# EAGLE design ucbeacon (EAGLE 6.6.0)

## Sheet 1 of 3: Logic
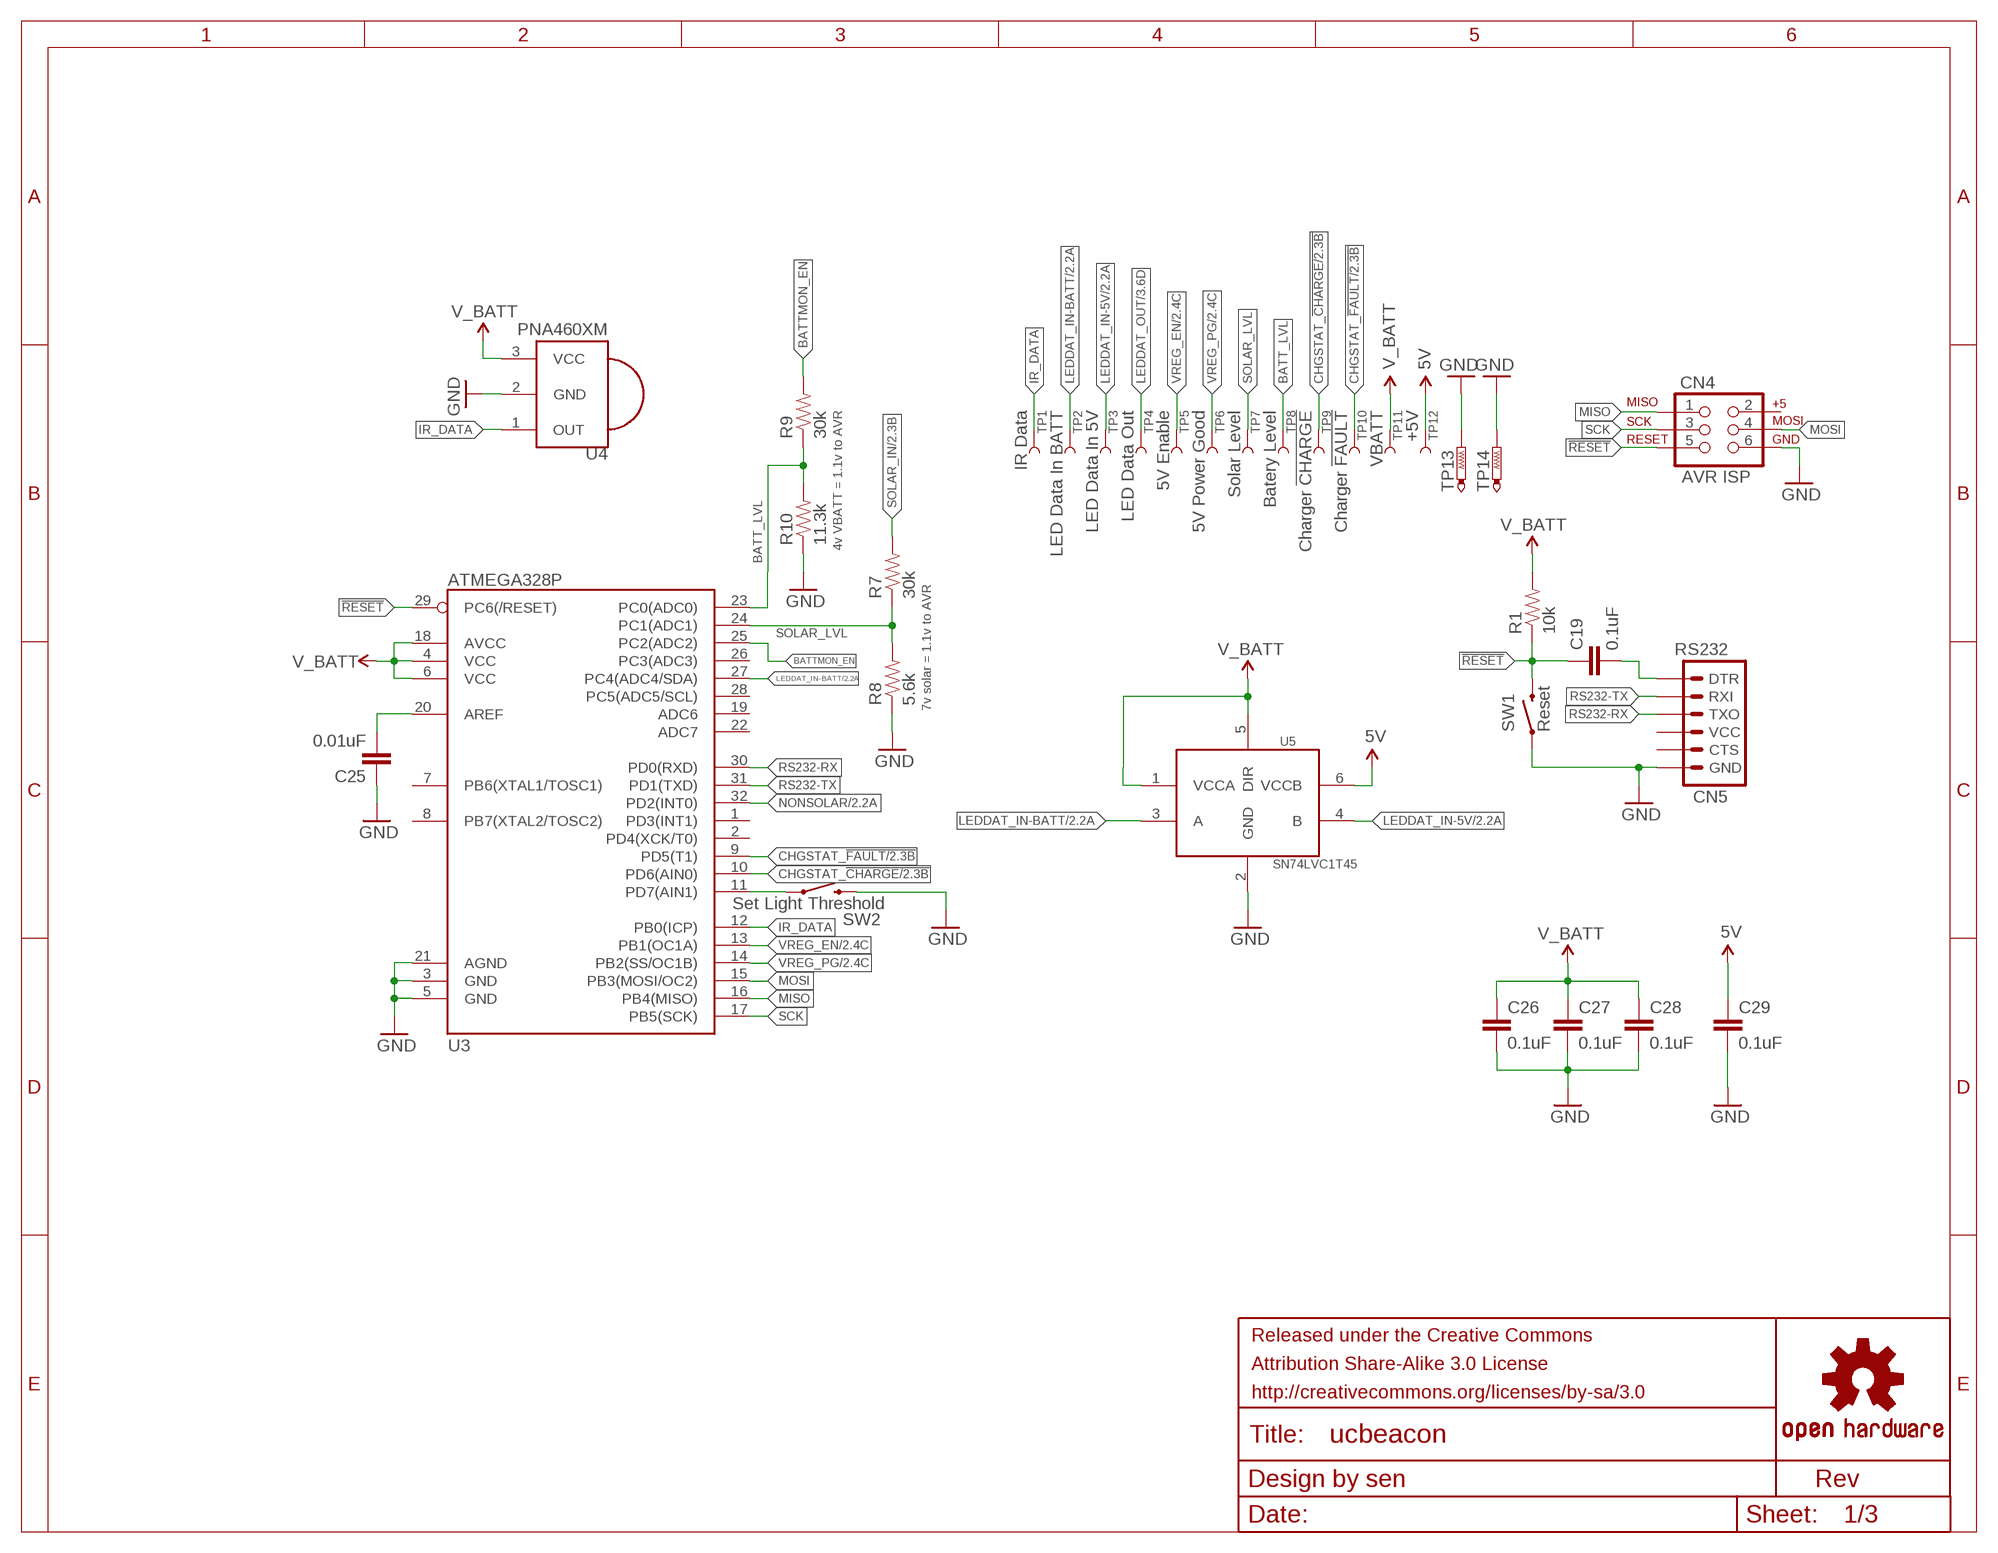
[diagram p0: schematic, sheet 1]

### Parts
C19  0.1uF  0.1UF-25V(+80/-20%)(0603)  [0603-CAP]
C25  0.01uF  0.1UF-25V(+80/-20%)(0603)  [0603-CAP]
C26  0.1uF  0.1UF-25V(+80/-20%)(0603)  [0603-CAP]
C27  0.1uF  0.1UF-25V(+80/-20%)(0603)  [0603-CAP]
C28  0.1uF  0.1UF-25V(+80/-20%)(0603)  [0603-CAP]
C29  0.1uF  0.1UF-25V(+80/-20%)(0603)  [0603-CAP]
CN4  AVR ISP  AVR_SPI_PRG_62X3_LOCK  [2X3_LOCK]
CN5  RS232  ARDUINO_SERIAL_PROGRAMLOCK  [1X06_LOCK]
FRAME2  FRAME-LETTER-GRID-OSHW-SENOSHW-LOGO-L  [OSHW-LOGO-L]
R1  10k  RESISTOR0603-RES  [0603-RES]
R7  30k  RESISTOR0603-RES  [0603-RES]
R8  5.6k  RESISTOR0603-RES  [0603-RES]
R9  30k  RESISTOR0603-RES  [0603-RES]
R10  11.3k  RESISTOR0603-RES  [0603-RES]
SW1  Reset  SWITCH-MOMENTARY-2SMD-4  [TACTILE_SWITCH_TALL]
SW2  Set Light Threshold  SWITCH-MOMENTARY-2SMD-4  [TACTILE_SWITCH_TALL]
TP1  IR Data  TEST-POINTTP_15PTH-MASKBOT  [TP_15TH-MASKBOT]
TP2  LED Data In BATT  TEST-POINTTP_15PTH-MASKBOT  [TP_15TH-MASKBOT]
TP3  LED Data In 5V  TEST-POINTTP_15PTH-MASKBOT  [TP_15TH-MASKBOT]
TP4  LED Data Out  TEST-POINTTP_15PTH-MASKBOT  [TP_15TH-MASKBOT]
TP5  5V Enable  TEST-POINTTP_15PTH-MASKBOT  [TP_15TH-MASKBOT]
TP6  5V Power Good  TEST-POINTTP_15PTH-MASKBOT  [TP_15TH-MASKBOT]
TP7  Solar Level  TEST-POINTTP_15PTH-MASKBOT  [TP_15TH-MASKBOT]
TP8  Batery Level  TEST-POINTTP_15PTH-MASKBOT  [TP_15TH-MASKBOT]
TP9  Charger !CHARGE  TEST-POINTTP_15PTH-MASKBOT  [TP_15TH-MASKBOT]
TP10  Charger !FAULT  TEST-POINTTP_15PTH-MASKBOT  [TP_15TH-MASKBOT]
TP11  VBATT  TEST-POINTTP_15PTH-MASKBOT  [TP_15TH-MASKBOT]
TP12  +5V  TEST-POINTTP_15TH_THRU  [TP_15TH]
TP13  GND  PTR1PAD1-13  [P1-13]
TP14  GND  PTR1PAD1-13  [P1-13]
U3  ATMEGA328P  ATMEGA328_SMT  [TQFP32-08]
U4  PNA460XM  [PNA460XM]
U5  SN74LVC1T45  [SOT23-6L]

### Nets
5V: C29.1 TP12.P$1 U5.6(VCCB) ; also sheet 2,3
!RESET: C19.1 CN4.5 R1.1 SW1.B2 U3.29(PC6(/RESET))
AREF: C25.2 U3.20(AREF)
BATT_LVL: R9.1 R10.2 TP8.P$1 U3.23(PC0(ADC0))
BATTMON_EN: R9.2 U3.25(PC2(ADC2))
CHGSTAT_!CHARGE: TP9.P$1 U3.10(PD6(AIN0)) ; also sheet 2
CHGSTAT_!FAULT: TP10.P$1 U3.9(PD5(T1)) ; also sheet 2
DTR_RESET: C19.2 CN5.1(DTR)
GND: C25.1 C26.2 C27.2 C28.2 C29.2 CN4.6 CN5.6(GND) R8.1 R10.1 SW1.A2 SW2.B2 TP13.TP TP14.TP U3.3(GND) U3.5(GND) U3.21(AGND) U4.2(GND) U5.2(GND) ; also sheet 2,3
IR_DATA: TP1.P$1 U3.12(PB0(ICP)) U4.1(OUT)
LEDDAT_IN-5V: TP3.P$1 U5.4(B) ; also sheet 2,3
LEDDAT_IN-BATT: TP2.P$1 U3.27(PC4(ADC4/SDA)) U5.3(A) ; also sheet 2
LEDDAT_OUT: TP4.P$1 ; also sheet 3
MISO: CN4.1 U3.16(PB4(MISO))
MOSI: CN4.4 U3.15(PB3(MOSI/OC2))
NONSOLAR: U3.32(PD2(INT0)) ; also sheet 2
RS232-RX: CN5.3(TXO) U3.30(PD0(RXD))
RS232-TX: CN5.2(RXI) U3.31(PD1(TXD))
SCK: CN4.3 U3.17(PB5(SCK))
SET_LIGHT_THRESH: SW2.A2 U3.11(PD7(AIN1))
SOLAR_IN: R7.2 ; also sheet 2
SOLAR_LVL: R7.1 R8.2 TP7.P$1 U3.24(PC1(ADC1))
V_BATT: C26.1 C27.1 C28.1 R1.2 TP11.P$1 U3.4(VCC) U3.6(VCC) U3.18(AVCC) U4.3(VCC) U5.1(VCCA) U5.5(DIR) ; also sheet 2
VREG_EN: TP5.P$1 U3.13(PB1(OC1A)) ; also sheet 2
VREG_PG: TP6.P$1 U3.14(PB2(SS/OC1B)) ; also sheet 2
Unconnected: CN4.2 CN5.4(VCC) CN5.5(CTS) U3.1(PD3(INT1)) U3.2(PD4(XCK/T0)) U3.7(PB6(XTAL1/TOSC1)) U3.8(PB7(XTAL2/TOSC2)) U3.19(ADC6) U3.22(ADC7) U3.26(PC3(ADC3)) U3.28(PC5(ADC5/SCL))

### Notes on the sheet
- 4v VBATT = 1.1v to AVR
- 7v solar = 1.1v to AVR

## Sheet 2 of 3: Power
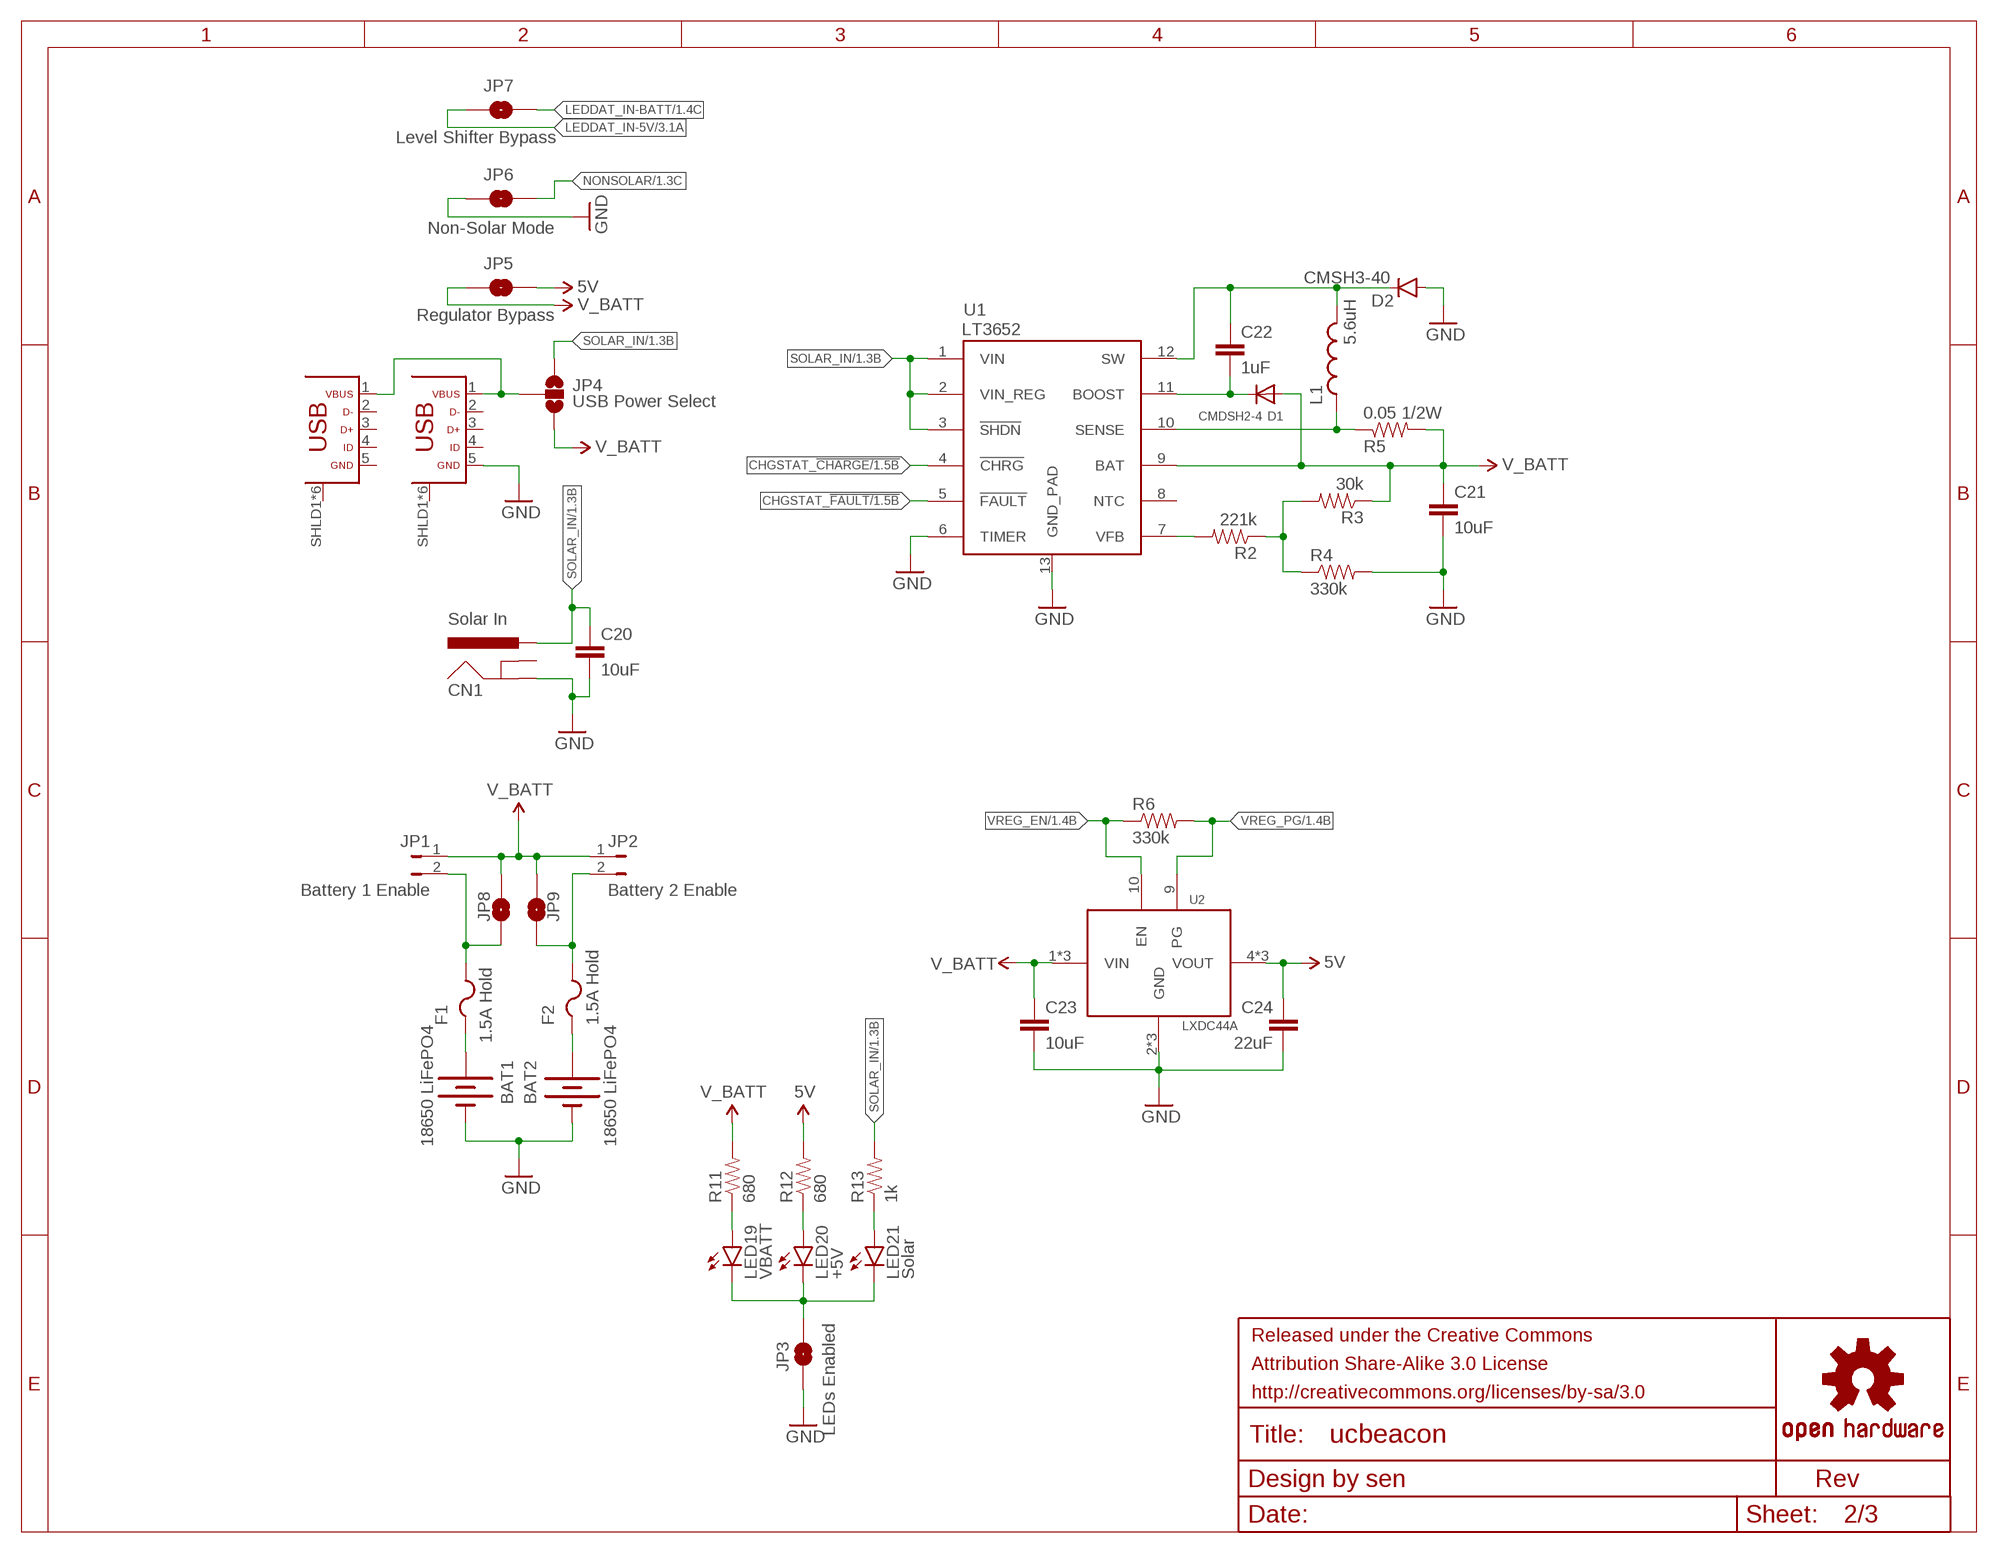
[diagram p1: schematic, sheet 2]

### Parts
BAT1  18650 LiFePO4  BATTERY18650  [BATTERY_18650-HOLDER]
BAT2  18650 LiFePO4  BATTERY18650  [BATTERY_18650-HOLDER]
C20  10uF  10UF10V10%(0805)  [0805-CAP]
C21  10uF  10UF10V10%(0805)  [0805-CAP]
C22  1uF  CAP0402-CAP  [0402-CAP]
C23  10uF  10UF10V10%(0805)  [0805-CAP]
C24  22uF  22UF-6.3V-20%(0805)  [0805]
CN1  Solar In  POWER_JACKPTH_LOCK  [POWER_JACK_PTH_LOCK]
CN2  Bottom USB  FCI-10118194-MICROUSB  [FCI-10118194-MICROUSB]
CN3  Top USB  FCI-10118194-MICROUSB  [FCI-10118194-MICROUSB]
D1  CMDSH2-4  DIODESOD-323F  [SOD-323F]
D2  CMSH3-40  DIODESMA  [SMA-DIODE]
F1  1.5A Hold  PTCFUSE-1812  [1812]
F2  1.5A Hold  PTCFUSE-1812  [1812]
FRAME3  FRAME-LETTER-GRID-OSHW-SENOSHW-LOGO-L  [OSHW-LOGO-L]
JP1  Battery 1 Enable  JUMPER-PTH-2-NO  [PTH-JUMPER-2-NO_NO_SILK]
JP2  Battery 2 Enable  JUMPER-PTH-2-NO  [PTH-JUMPER-2-NO_NO_SILK]
JP3  LEDs Enabled  JUMPER-PAD-2-NOYES_SILK  [PAD-JUMPER-2-NO_YES_SILK]
JP4  USB Power Select  JUMPER-PAD-3-NOYES_SILK  [PAD-JUMPER-3-NO_YES_SILK]
JP5  Regulator Bypass  JUMPER-PAD-2-NOYES_SILK  [PAD-JUMPER-2-NO_YES_SILK]
JP6  Non-Solar Mode  JUMPER-PAD-2-NOYES_SILK  [PAD-JUMPER-2-NO_YES_SILK]
JP7  Level Shifter Bypass  JUMPER-PAD-2-NOYES_SILK  [PAD-JUMPER-2-NO_YES_SILK]
JP8  Battery 1 Enable  JUMPER-PAD-2-NOYES_SILK  [PAD-JUMPER-2-NO_YES_SILK]
JP9  Battery 1 Enable  JUMPER-PAD-2-NOYES_SILK  [PAD-JUMPER-2-NO_YES_SILK]
L1  5.6uH  PULSE-P1167  [PULSE-P1167]
LED19  VBATT  LED-GREEN1206  [LED-1206]
LED20  +5V  LED-GREEN1206  [LED-1206]
LED21  Solar  LED-GREEN1206  [LED-1206]
R2  221k  RESISTOR0603  [0603-RES]
R3  30k  RESISTOR0603  [0603-RES]
R4  330k  RESISTOR0603  [0603-RES]
R5  0.05 1/2W  RESISTOR1206  [1206]
R6  330k  RESISTOR0603  [0603-RES]
R11  680  RESISTOR0603-RES  [0603-RES]
R12  680  RESISTOR0603-RES  [0603-RES]
R13  1k  RESISTOR0603-RES  [0603-RES]
U1  LT3652  [MSOP-12_GND]
U2  LXDC44A  [LXDC44A]

### Nets
5V: C24.1 JP5.2 R12.2 U2.4(VOUT) U2.5(VOUT) U2.6(VOUT) ; also sheet 1,3
5V_LED: LED20.A R12.1
BAT1_F: BAT1.PWR@1(+) F1.1
BAT1_PREJMP: F1.2 JP1.2 JP8.2
BAT2_F: BAT2.PWR@1(+) F2.1
BAT2_PREJMP: F2.2 JP2.2 JP9.2
CHG_BOOST: C22.2 D1.C U1.11(BOOST)
CHG_SENSE: L1.2 R5.1 U1.10(SENSE)
CHG_SW: C22.1 D2.C L1.1 U1.12(SW)
CHG_VFB: R2.2 U1.7(VFB)
CHG_VFB_CTR: R2.1 R3.2 R4.1
CHGSTAT_!CHARGE: U1.4(!CHRG) ; also sheet 1
CHGSTAT_!FAULT: U1.5(!FAULT) ; also sheet 1
GND: BAT1.GND@1(-) BAT2.GND@1(-) C20.2 C21.2 C23.2 C24.2 CN1.GND CN2.5(GND) D2.A JP3.1 JP6.1 R4.2 U1.6(TIMER) U1.13(GND_PAD) U2.2(GND) U2.3(GND) U2.8(GND) ; also sheet 1,3
LED_GND: JP3.2 LED19.C LED20.C LED21.C
LEDDAT_IN-5V: JP7.1 ; also sheet 1,3
LEDDAT_IN-BATT: JP7.2 ; also sheet 1
NONSOLAR: JP6.2 ; also sheet 1
SOLAR_IN: C20.1 CN1.PWR JP4.1 R13.2 U1.1(VIN) U1.2(VIN_REG) U1.3(!SHDN) ; also sheet 1
SOLAR_LED: LED21.A R13.1
USB_VBUS: CN2.1(VBUS) CN3.1(VBUS) JP4.2
V_BATT: C21.1 C23.1 D1.A JP1.1 JP2.1 JP4.3 JP5.1 JP8.1 JP9.1 R3.1 R5.2 R11.2 U1.9(BAT) U2.1(VIN) U2.11(VIN) U2.12(VIN) ; also sheet 1
VBATT_LED: LED19.A R11.1
VREG_EN: R6.1 U2.10(EN) ; also sheet 1
VREG_PG: R6.2 U2.9(PG) ; also sheet 1
Unconnected: CN1.GNDBREAK CN2.2(D-) CN2.3(D+) CN2.4(ID) CN2.SHLD1(SHLD) CN2.SHLD2(SHLD) CN2.SHLD3(SHLD) CN2.SHLD4(SHLD) CN2.SHLD5(SHLD) CN2.SHLD6(SHLD) CN3.2(D-) CN3.3(D+) CN3.4(ID) CN3.SHLD1(SHLD) CN3.SHLD2(SHLD) CN3.SHLD3(SHLD) CN3.SHLD4(SHLD) CN3.SHLD5(SHLD) CN3.SHLD6(SHLD) U1.8(NTC)

## Sheet 3 of 3: LEDs
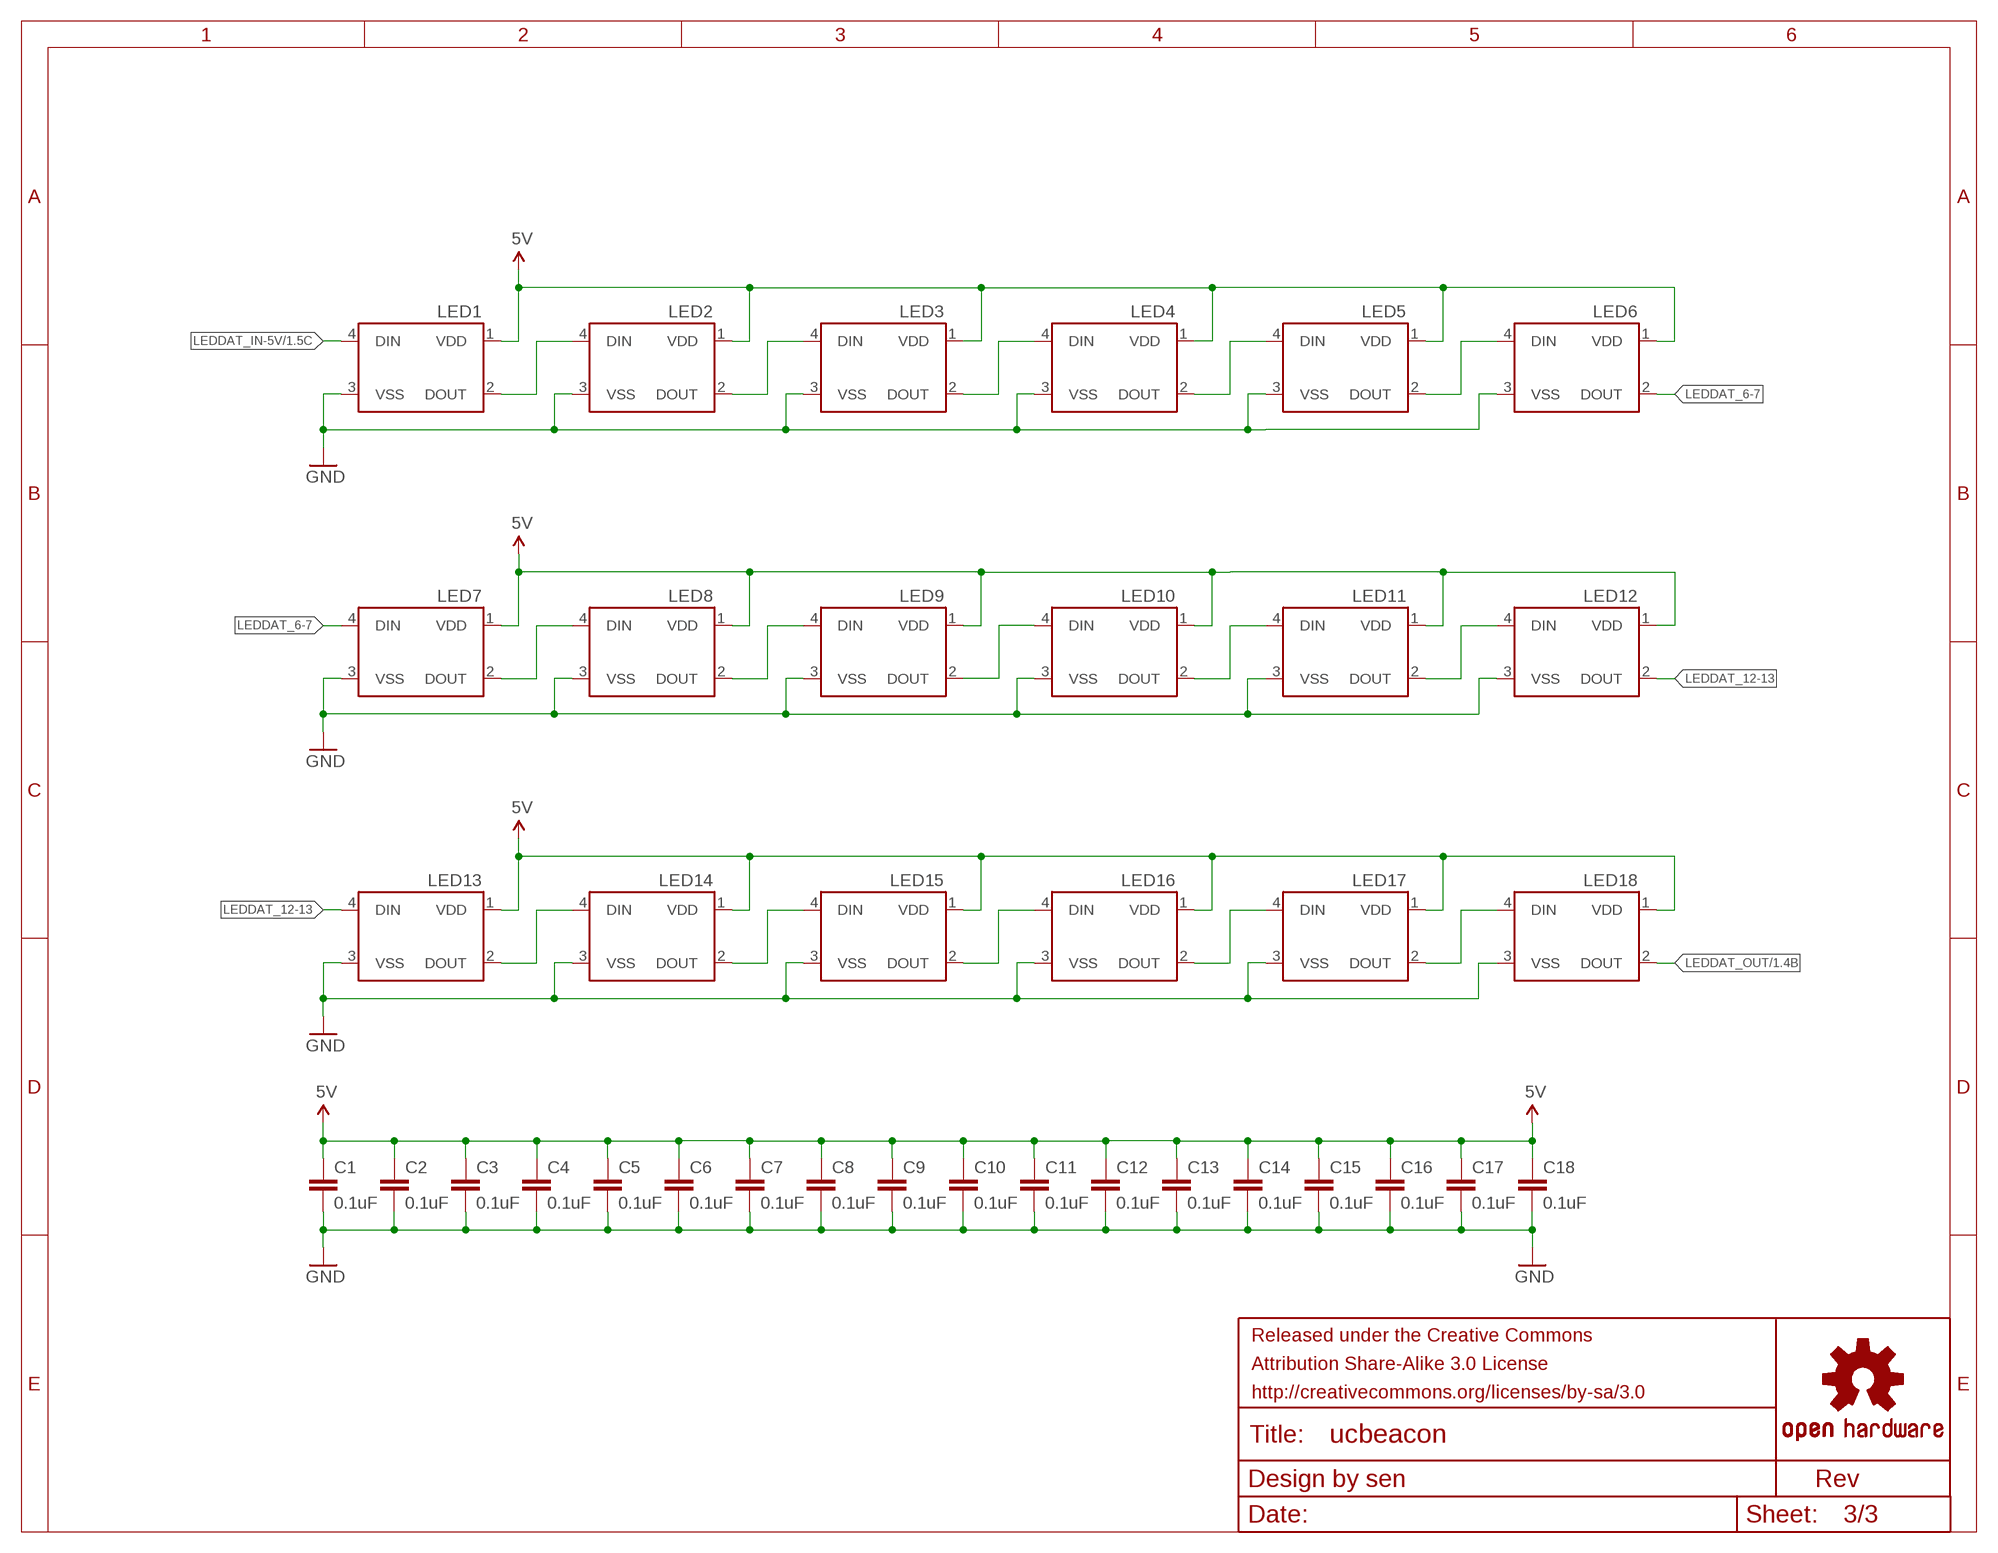
[diagram p2: schematic, sheet 3]

### Parts
C1  0.1uF  0.1UF-25V(+80/-20%)(0603)  [0603-CAP]
C2  0.1uF  0.1UF-25V(+80/-20%)(0603)  [0603-CAP]
C3  0.1uF  0.1UF-25V(+80/-20%)(0603)  [0603-CAP]
C4  0.1uF  0.1UF-25V(+80/-20%)(0603)  [0603-CAP]
C5  0.1uF  0.1UF-25V(+80/-20%)(0603)  [0603-CAP]
C6  0.1uF  0.1UF-25V(+80/-20%)(0603)  [0603-CAP]
C7  0.1uF  0.1UF-25V(+80/-20%)(0603)  [0603-CAP]
C8  0.1uF  0.1UF-25V(+80/-20%)(0603)  [0603-CAP]
C9  0.1uF  0.1UF-25V(+80/-20%)(0603)  [0603-CAP]
C10  0.1uF  0.1UF-25V(+80/-20%)(0603)  [0603-CAP]
C11  0.1uF  0.1UF-25V(+80/-20%)(0603)  [0603-CAP]
C12  0.1uF  0.1UF-25V(+80/-20%)(0603)  [0603-CAP]
C13  0.1uF  0.1UF-25V(+80/-20%)(0603)  [0603-CAP]
C14  0.1uF  0.1UF-25V(+80/-20%)(0603)  [0603-CAP]
C15  0.1uF  0.1UF-25V(+80/-20%)(0603)  [0603-CAP]
C16  0.1uF  0.1UF-25V(+80/-20%)(0603)  [0603-CAP]
C17  0.1uF  0.1UF-25V(+80/-20%)(0603)  [0603-CAP]
C18  0.1uF  0.1UF-25V(+80/-20%)(0603)  [0603-CAP]
FRAME1  FRAME-LETTER-GRID-OSHW-SENOSHW-LOGO-L  [OSHW-LOGO-L]
LED1  WS2812B  [WS2812B]
LED2  WS2812B  [WS2812B]
LED3  WS2812B  [WS2812B]
LED4  WS2812B  [WS2812B]
LED5  WS2812B  [WS2812B]
LED6  WS2812B  [WS2812B]
LED7  WS2812B  [WS2812B]
LED8  WS2812B  [WS2812B]
LED9  WS2812B  [WS2812B]
LED10  WS2812B  [WS2812B]
LED11  WS2812B  [WS2812B]
LED12  WS2812B  [WS2812B]
LED13  WS2812B  [WS2812B]
LED14  WS2812B  [WS2812B]
LED15  WS2812B  [WS2812B]
LED16  WS2812B  [WS2812B]
LED17  WS2812B  [WS2812B]
LED18  WS2812B  [WS2812B]

### Nets
5V: C1.1 C2.1 C3.1 C4.1 C5.1 C6.1 C7.1 C8.1 C9.1 C10.1 C11.1 C12.1 C13.1 C14.1 C15.1 C16.1 C17.1 C18.1 LED1.1(VDD) LED2.1(VDD) LED3.1(VDD) LED4.1(VDD) LED5.1(VDD) LED6.1(VDD) LED7.1(VDD) LED8.1(VDD) LED9.1(VDD) LED10.1(VDD) LED11.1(VDD) LED12.1(VDD) LED13.1(VDD) LED14.1(VDD) LED15.1(VDD) LED16.1(VDD) LED17.1(VDD) LED18.1(VDD) ; also sheet 1,2
GND: C1.2 C2.2 C3.2 C4.2 C5.2 C6.2 C7.2 C8.2 C9.2 C10.2 C11.2 C12.2 C13.2 C14.2 C15.2 C16.2 C17.2 C18.2 LED1.3(VSS) LED2.3(VSS) LED3.3(VSS) LED4.3(VSS) LED5.3(VSS) LED6.3(VSS) LED7.3(VSS) LED8.3(VSS) LED9.3(VSS) LED10.3(VSS) LED11.3(VSS) LED12.3(VSS) LED13.3(VSS) LED14.3(VSS) LED15.3(VSS) LED16.3(VSS) LED17.3(VSS) LED18.3(VSS) ; also sheet 1,2
LEDDAT_1-2: LED1.2(DOUT) LED2.4(DIN)
LEDDAT_2-3: LED2.2(DOUT) LED3.4(DIN)
LEDDAT_3-4: LED3.2(DOUT) LED4.4(DIN)
LEDDAT_4-5: LED4.2(DOUT) LED5.4(DIN)
LEDDAT_5-6: LED5.2(DOUT) LED6.4(DIN)
LEDDAT_6-7: LED6.2(DOUT) LED7.4(DIN)
LEDDAT_7-8: LED7.2(DOUT) LED8.4(DIN)
LEDDAT_8-9: LED8.2(DOUT) LED9.4(DIN)
LEDDAT_9-10: LED9.2(DOUT) LED10.4(DIN)
LEDDAT_10-11: LED10.2(DOUT) LED11.4(DIN)
LEDDAT_11-12: LED11.2(DOUT) LED12.4(DIN)
LEDDAT_12-13: LED12.2(DOUT) LED13.4(DIN)
LEDDAT_13-14: LED13.2(DOUT) LED14.4(DIN)
LEDDAT_14-15: LED14.2(DOUT) LED15.4(DIN)
LEDDAT_15-16: LED15.2(DOUT) LED16.4(DIN)
LEDDAT_16-17: LED16.2(DOUT) LED17.4(DIN)
LEDDAT_17-18: LED17.2(DOUT) LED18.4(DIN)
LEDDAT_IN-5V: LED1.4(DIN) ; also sheet 1,2
LEDDAT_OUT: LED18.2(DOUT) ; also sheet 1

## Power pins joined to a net without a drawn wire
GND: CN3.5(GND)

## Library data of the parts
BAT1 BAT2 = SparkFun-Electromechanical:BATTERY: Battery Holders Various common sizes : AA, AAA, 18650 (PRT-12895), 20mm coin cell and 12mm coin cell. 20MM_4LEGS, BATT-10373
C1-C19 C26-C29 = SparkFun-Capacitors:0.1UF-25V(+80/-20%)(0603): CAP-00810 Ceramic Standard decoupling cap; PROD_ID: CAP-00810
C20 C21 C23 = SparkFun-Capacitors:10UF10V10%(0805): CAP-11330; PROD_ID: CAP-11330
C22 = SparkFun-Capacitors:CAP: Capacitor Standard 0603 ceramic capacitor, and 0.1" leaded capacitor.
C24 = SparkFun-Capacitors:22UF-6.3V-20%(0805): CAP-08402 Ceramic; PROD_ID: CAP-08402
C25 = SparkFun-Capacitors:0.1UF-25V(+80/-20%)(0603): CAP-00810 Ceramic Standard decoupling cap; PROD_ID: CAP-00810; VALUE: 0.1uF
CN1 = SparkFun-Connectors:POWER_JACK: Power Jack This is the standard 5.5mm barrel jack for power. The PTH is the most common, proven, reliable, footprint. The Slot footprint only works if the mill layer is transmitted to the PCB fab house so be warned. Mating wall wart : TOL-00298 (and others); PROD_ID: CONN-08197; SF_ID: PRT-00119
CN2 CN3 = con-sen:FCI-10118194-MICROUSB: Micro USB-B SMD pins, through-hole shield
CN4 = SparkFun-Connectors:AVR_SPI_PRG_6: AVR ISP 6 Pin This is the reduced ISP connector for AVR programming. Common on Arduino. This footprint will take up less PCB space and can be used with a 10-pin to 6-pin adapter such as SKU: BOB-08508 **Special note about "TEST_POINT" package. The stop mask is on the top side, so if you want your programming test points to be on the bottom of your board, make sure to place this package on the bottom side of the board. This also ensure that the orientation to program from the bottom side will be correct.
CN5 = SparkFun-Connectors:ARDUINO_SERIAL_PROGRAM: FTDI connector footprints
D1 = adafruit:DIODE: Diode
D2 = SparkFun-DiscreteSemi:DIODE: Diode
F1 F2 = adafruit:PTCFUSE: PTC fuses, resettable thermistors
FRAME1-FRAME3 = logos-sen:FRAME-LETTER-GRID-OSHW-SEN: Landscape letter-sized schematic frame w/ OSHW logo, edge grid; REV: 001
JP1 JP2 = SparkFun-Passives:JUMPER-PTH-2-NO
JP3 JP5-JP9 = SparkFun-Passives:JUMPER-PAD-2-NO
JP4 = SparkFun-Passives:JUMPER-PAD-3-NO
L1 = inductor-sen:PULSE-P1167
LED1-LED18 = SparkFun-LED:WS2812B: WS2812B - Intelligent control LED integrated light source Technical Specifications: Power Supply Voltage (VDD): 3.5 to 5.3 V Input Voltage (VI): -0.5 to VDD+0.5 V Operating Junction Temperature (Topt): -25°C to +80°C Storage Temperature Range (Tstg): -55°C to +150°C
LED19-LED21 = SparkFun-LED:LED-GREEN: Various green LEDs Green LEDs used in SFE Production 0603- DIO-00821 LARGE- DIO-00862 LILYPAD- DIO-09910; PROD_ID: DIO-00862; VALUE: GREEN
R1 R7-R13 = SparkFun-Passives:RESISTOR: Resistor Basic schematic elements and footprints for 0603, 1206, and PTH resistors.
R2-R6 = SparkFun-Resistors:RESISTOR: Resistor Basic schematic elements and footprints for 0603, 1206, and PTH resistors.
SW1 SW2 = SparkFun-Electromechanical:SWITCH-MOMENTARY-2: Various NO switches- pushbuttons, reed, etc; PROD_ID: SWCH-11966
TP1-TP11 = con-sen:TEST-POINT: Test points
TP12 = SparkFun-Passives:TEST-POINT: Bare copper test points for troubleshooting or ICT
TP13 TP14 = testpad:PTR1: TEST PIN
U1 = SparkFun-PowerIC:LT3652: LT3652 MPPT Solar Charge Controller 5V-32V smart charger for batteries up to 14.4V
U2 = murata-sen:LXDC44A: Murata LXDC44A integrated DC/DC boost converter
U3 = SparkFun-DigitalIC:ATMEGA328_SMT: 32-Pin Atmega328 part Commonly used on Arduino compatible boards Available in QFP and QFN packages TQFP is IC-09069 QFN is non-stock; PROD_ID: IC-09069
U4 = adafruit:PNA460XM: IR 38KHz receiver PNA4602 and related receivers http://www.ladyada.net/library/pcb/eaglelibrary.html
U5 = texas-sen:SN74LVC1T45: Single-channel level shifter/translator

## Board
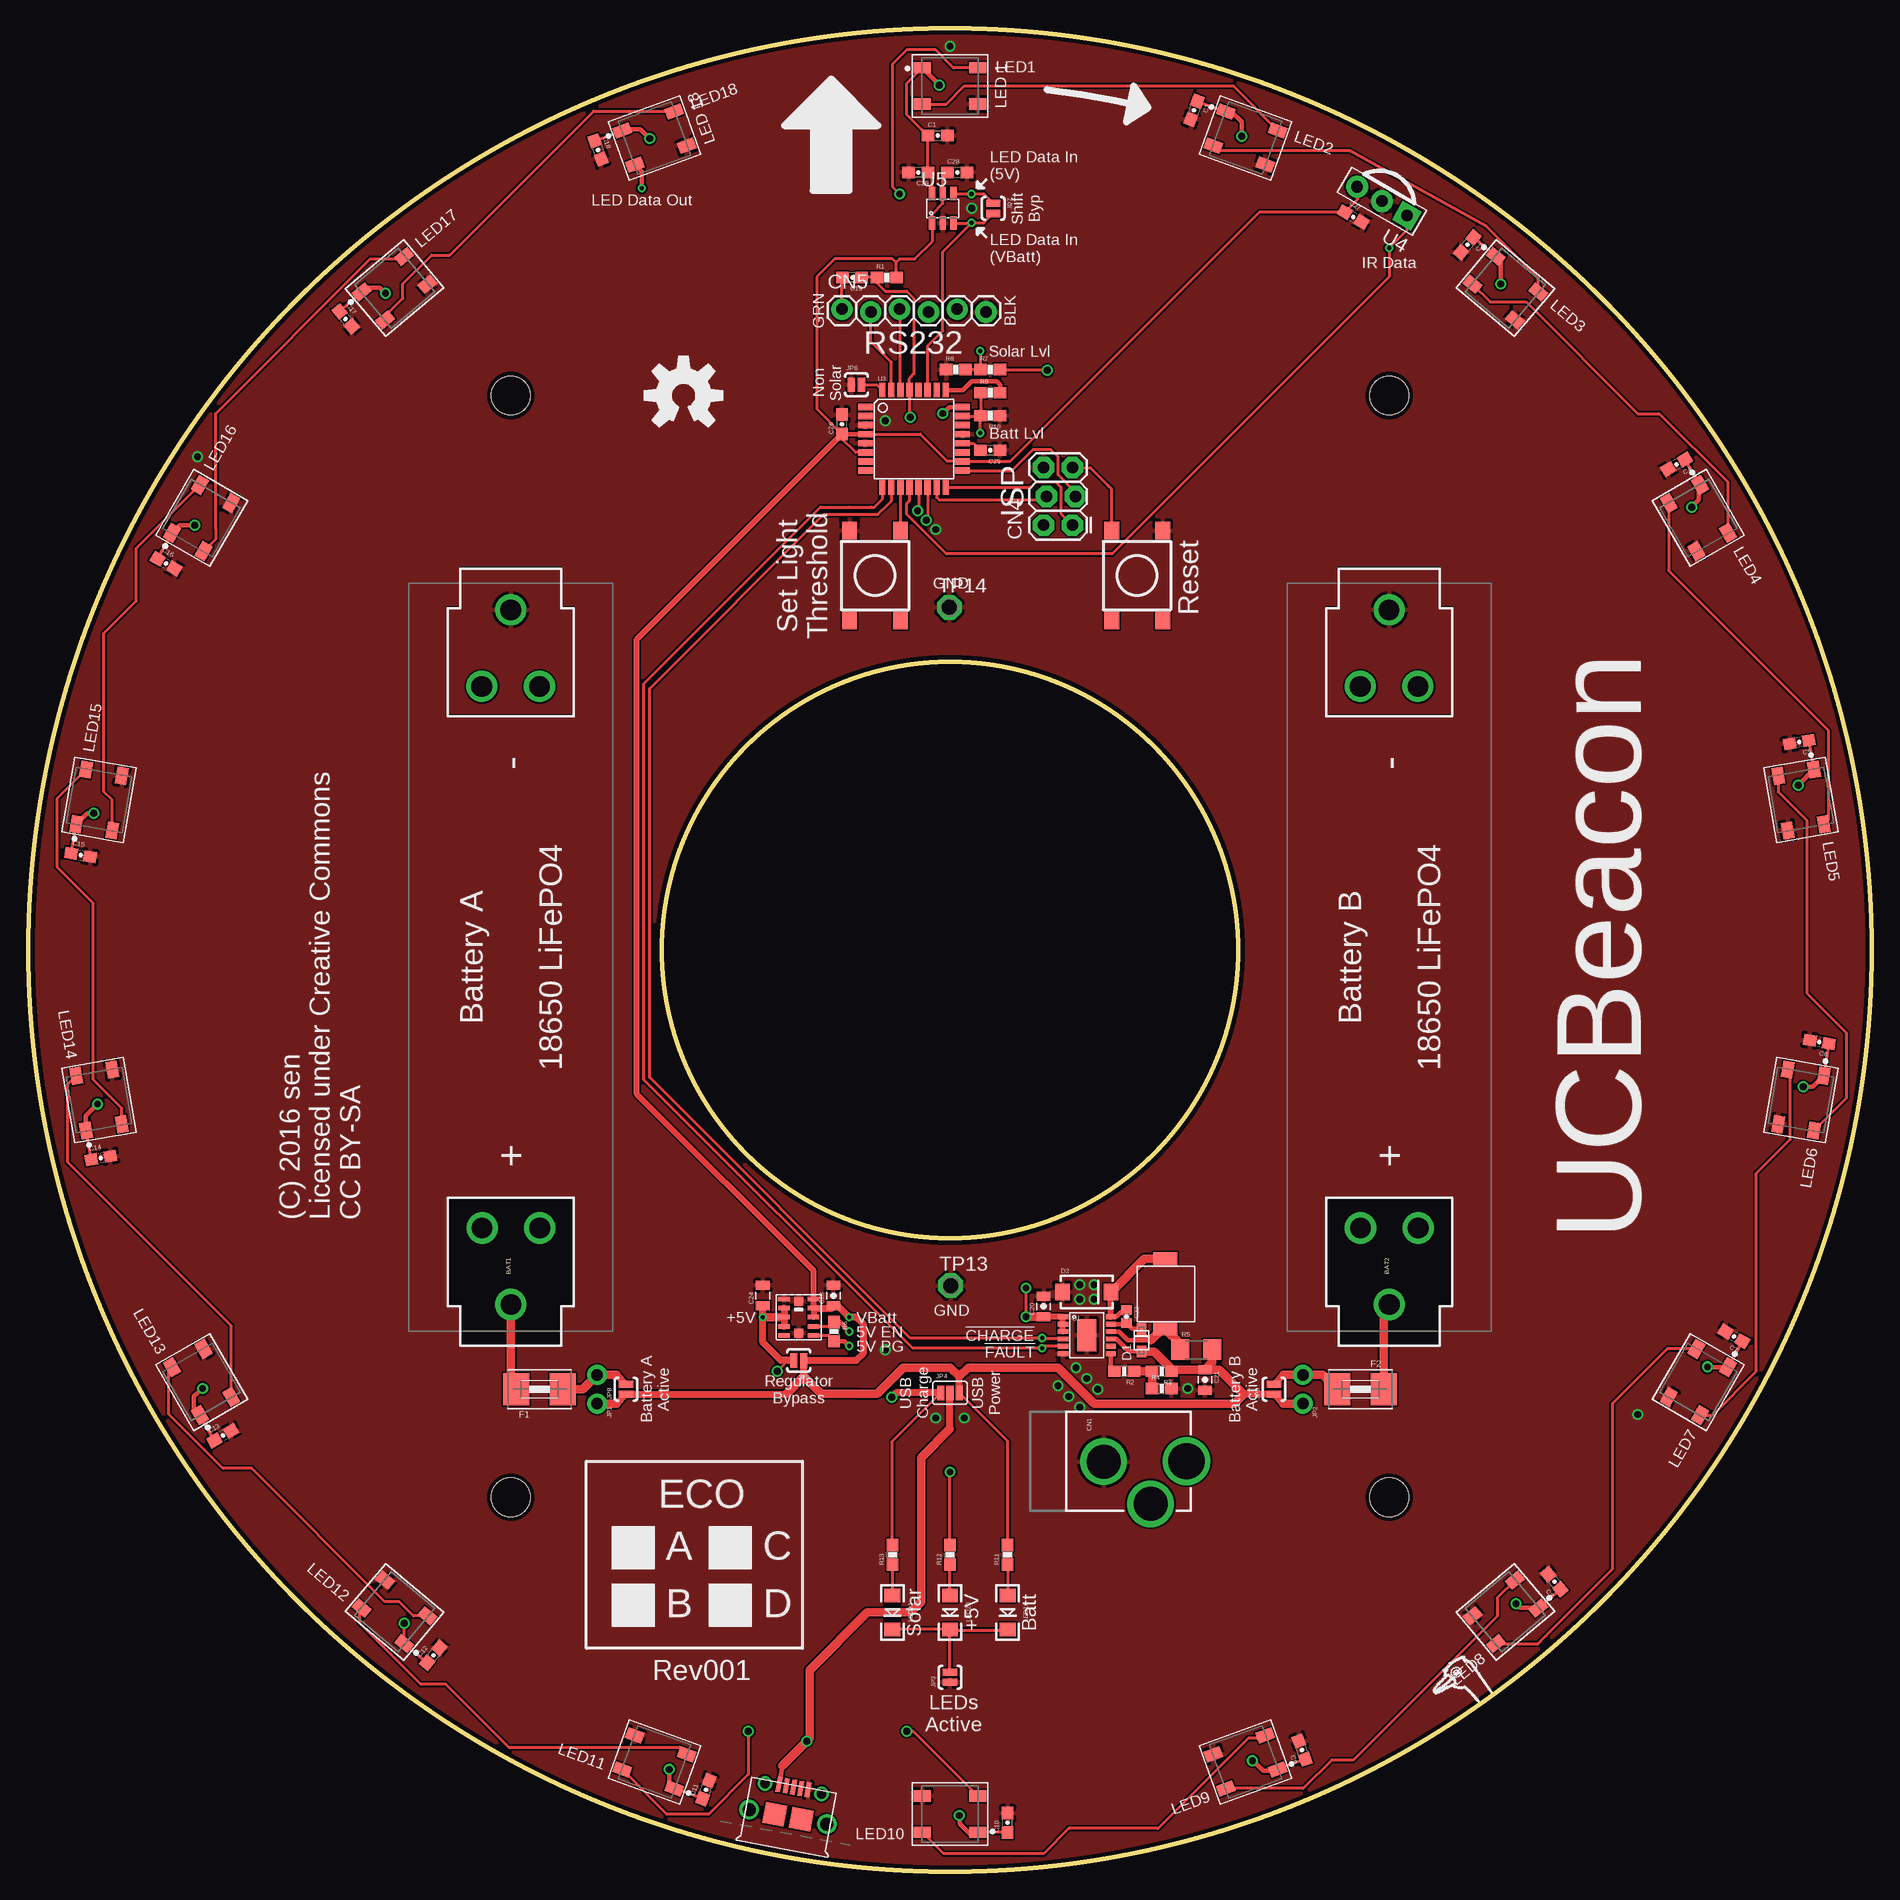
[diagram p3: board, top side]
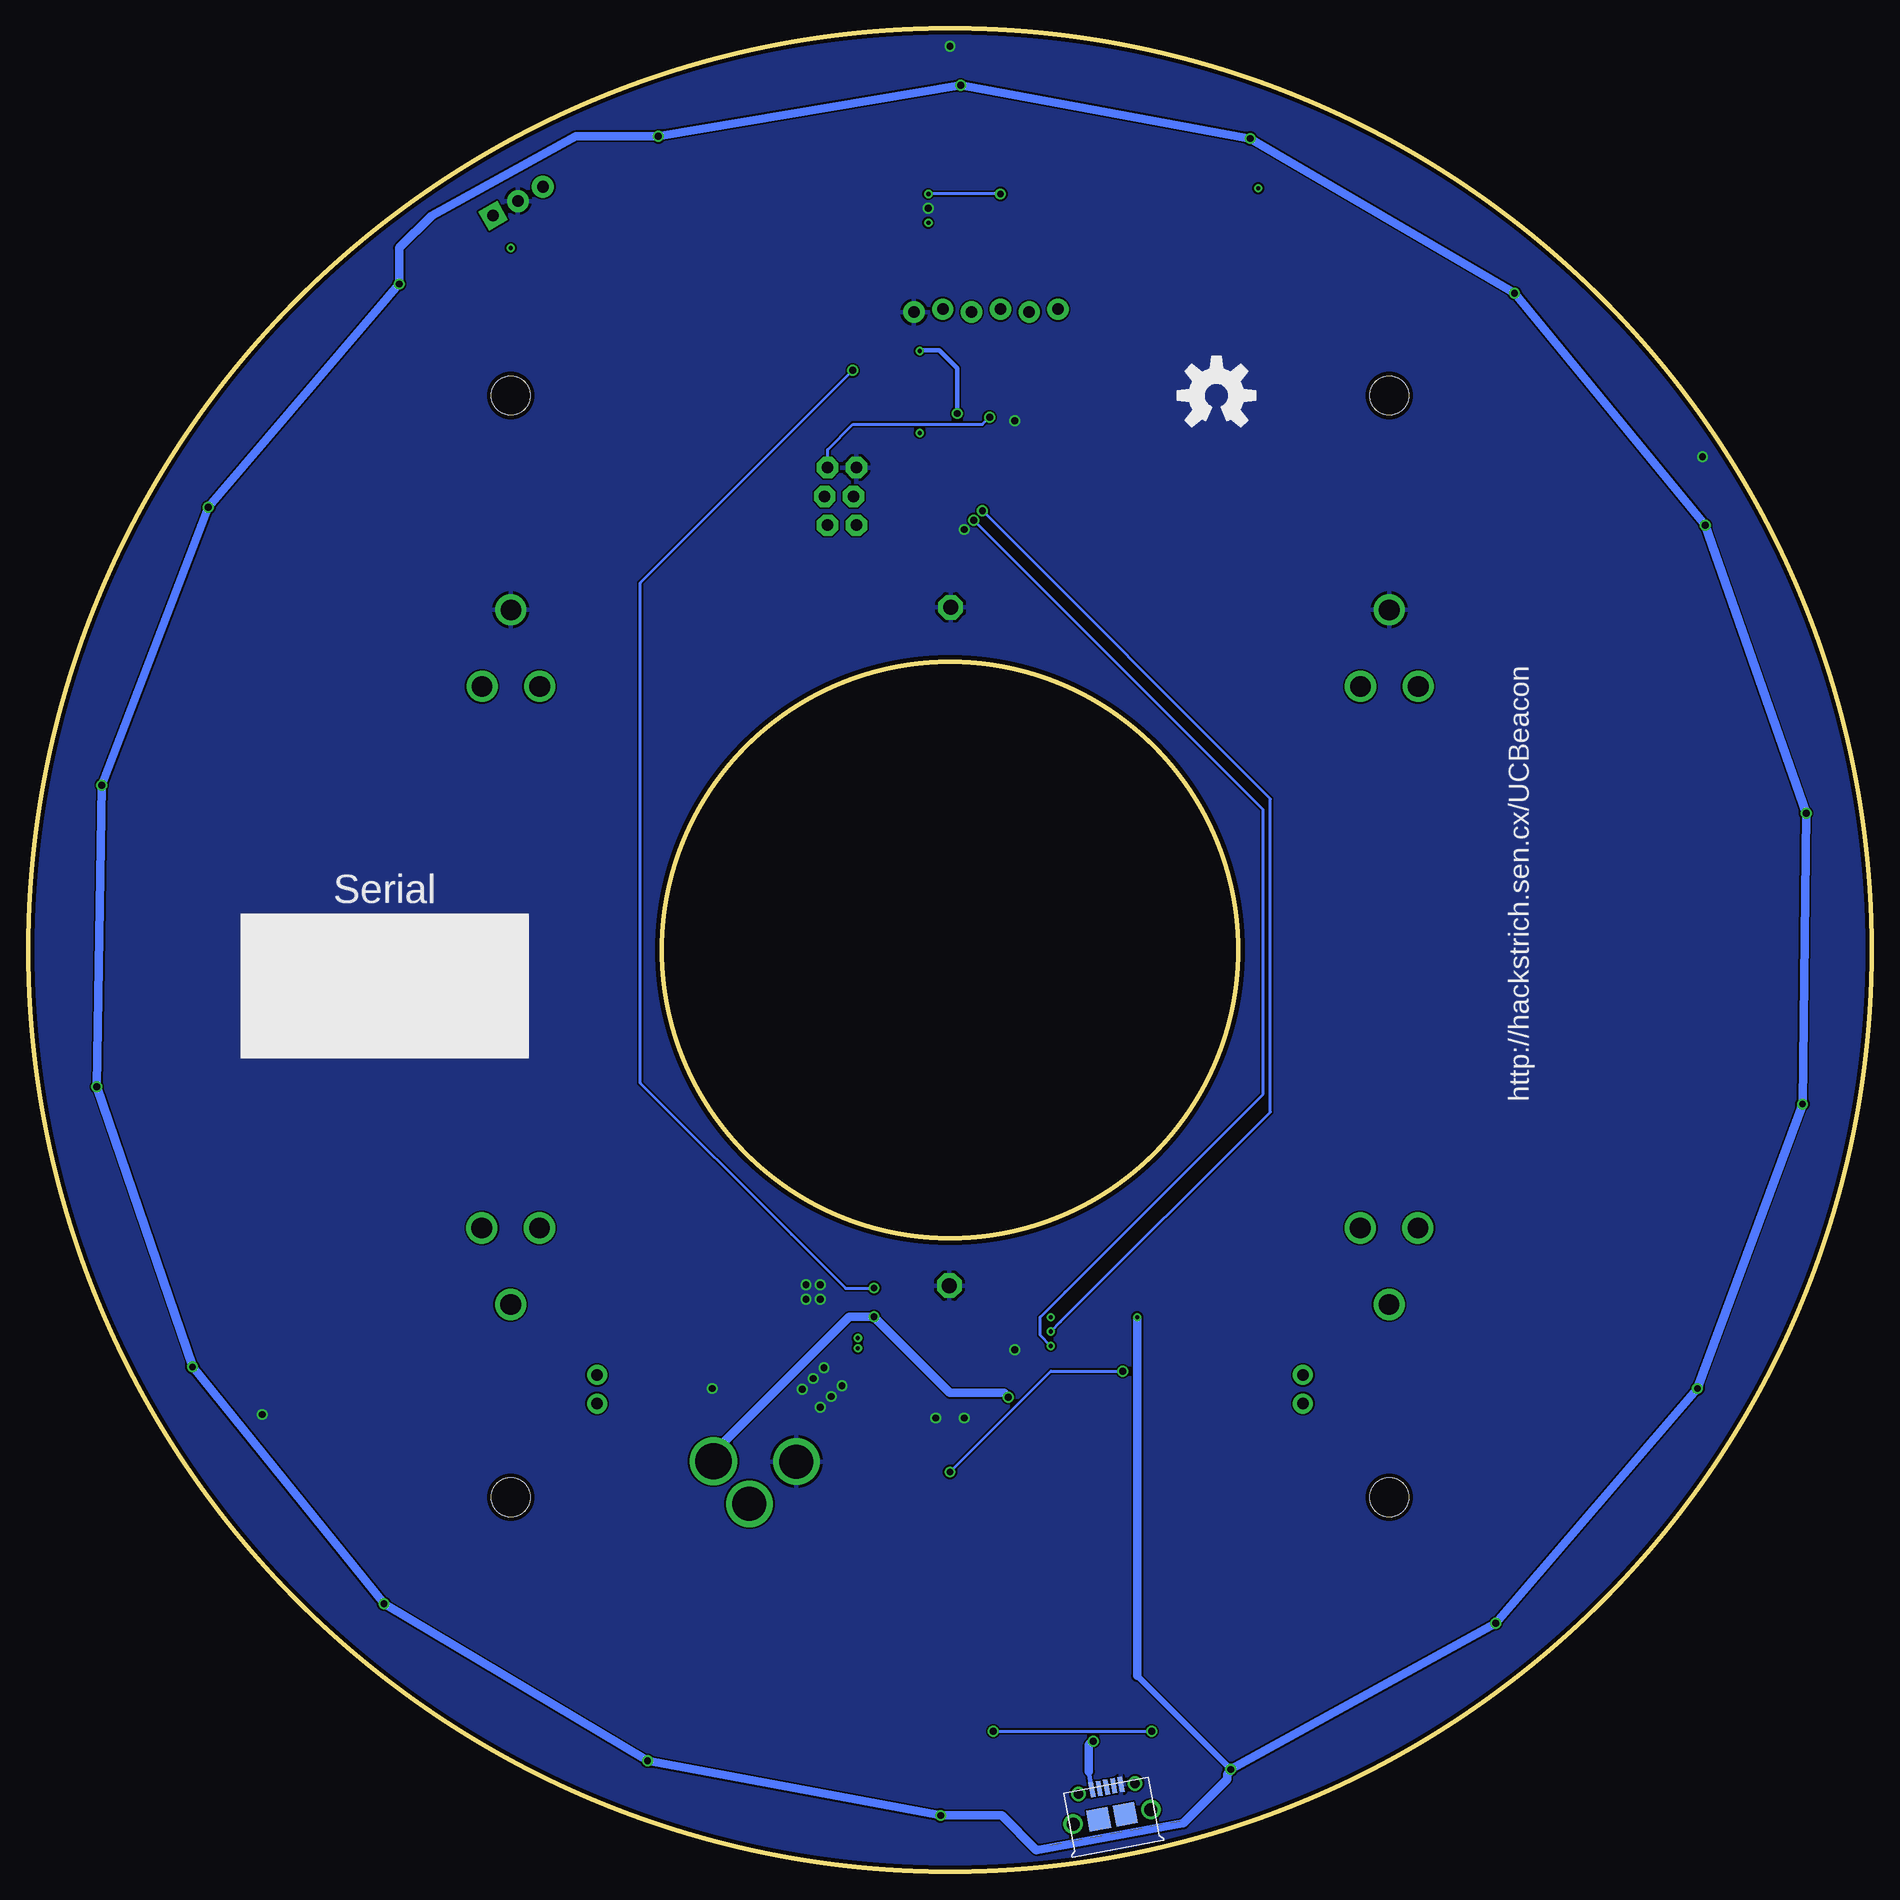
[diagram p4: board, bottom side, seen from below]

Size 162.56 x 162.56 mm. Coordinates in mm from the lower left corner, seen from the top.
Outline: circle at 81.28,81.28 radius 81.28
Outline: circle at 81.28,81.28 radius 25.4
Copper layers (1*16): Top 0.0356mm / dielectric 1.5011mm / Bottom 0.0356mm
Design rules "LaenPCBOrder-sen *": minimum track width 6mil, minimum drill 13mil, track to track 6mil, track to pad 6mil, pad to pad 6mil, via to via 6mil, smd to smd 6mil, copper to edge 15mil, drill to drill 6mil, minimum pad ring 7mil, minimum via ring 7mil, stop-mask expansion 4mil, vias tented up to drill 25mil, thermal gap 10mil
Holes 3.4 mm at 42.55,130.18 120.02,130.18 42.55,33.02 120.02,33.02

### Footprints (pad centres in the part's own frame; a part is rotated, then mirrored left to right if it is on the bottom)
BATTERY_18650-HOLDER = drill 1.829: GND@1 30.628,0.01; GND@2 23.88,2.55; GND@3 23.88,-2.53; PWR@1 -30.628,-0.01; PWR@2 -23.88,2.53; PWR@3 -23.88,-2.55
0603-CAP = smd 1.1 x 1: 1 -0.85,0; 2 0.85,0
0805-CAP = smd 0.8 x 1.2: 1 -0.9,0; 2 0.9,0
0402-CAP = smd 0.85 x 0.9: 1 -0.58,0; 2 0.58,0
0805 = smd 0.8 x 1.2: 1 -0.9,0; 2 0.9,0
POWER_JACK_PTH_LOCK = drill 2.997 pad 4.115: GND 0.025,6.557; GNDBREAK 3.762,10.7 | drill 3.2 pad 4.115: PWR 0,13.878
FCI-10118194-MICROUSB = smd 0.4 x 1.35: 1 -1.3,2.675; 2 -0.65,2.675; 3 0,2.675; 4 0.65,2.675; 5 1.3,2.675 | drill 1.15: SHLD1 -3.493,0; SHLD4 3.493,0 | smd 1.9 x 1.9: SHLD2 -1.2,0.025; SHLD3 1.2,0.025 | drill 0.85: SHLD5 -2.54,2.54; SHLD6 2.54,2.54
2X3_LOCK = drill 1.016 pad 1.88 octagon: 1 0,0; 2 0,2.54; 3 2.54,-0.254; 4 2.54,2.286; 5 5.08,0; 6 5.08,2.54
1X06_LOCK = drill 1.016 pad 1.88: 1 0,0; 2 2.54,-0.254; 3 5.08,0; 4 7.62,-0.254; 5 10.16,0; 6 12.7,-0.254
SOD-323F = smd 1 x 0.8: A -1,0; C 1,0
SMA-DIODE = smd 1.27 x 1.47: A -2.15,0; C 2.15,0
1812 = smd 2.286 x 2.794: 1 -2.046,0; 2 2.046,0
PTH-JUMPER-2-NO_NO_SILK = drill 1.016 pad 1.778: 1 -1.27,0; 2 1.27,0
PAD-JUMPER-2-NO_YES_SILK = smd 0.635 x 1.27: 1 -0.45,0; 2 0.45,0
PAD-JUMPER-3-NO_YES_SILK = smd 0.635 x 1.27: 1 -0.813,0; 2 0,0; 3 0.813,0
PULSE-P1167 = smd 1.145 x 2.11: 1 -3.104,-0.051; 2 3.071,-0.051
WS2812B = smd 1.5 x 1: 1 -2.45,1.6; 2 -2.45,-1.6; 3 2.45,-1.6; 4 2.45,1.6
LED-1206 = smd 1.2 x 1.4: A -1.5,0; C 1.5,0
0603-RES = smd 1.1 x 1: 1 -0.85,0; 2 0.85,0
1206 = smd 1.6 x 1.8: 1 -1.4,0; 2 1.4,0
TACTILE_SWITCH_TALL = smd 1.55 x 1.3: A1 -3.975,-2.25; A2 3.975,-2.25; B1 -3.975,2.25; B2 3.975,2.25
TP_15TH-MASKBOT = drill 0.381 pad 0.61: P$1 0,0
TP_15TH = drill 0.381 pad 0.61: P$1 0,0
P1-13 = drill 1.321 pad 2.159 octagon: TP 0,0
MSOP-12_GND = smd 0.889 x 0.42: 1 -2.1,1.625; 2 -2.1,0.975; 3 -2.1,0.325; 4 -2.1,-0.325; 5 -2.1,-0.975; 6 -2.1,-1.625; 7 2.1,-1.625; 8 2.1,-0.975; 9 2.1,-0.325; 10 2.1,0.325; 11 2.1,0.975; 12 2.1,1.625 | smd 1.651 x 2.845: 13 0,0
LXDC44A = smd 1 x 0.4: 1 1.3,1.6; 3 -1.3,1.6; 4 -1.3,0.8; 5 -1.3,0; 6 -1.3,-0.8; 7 -1.3,-1.6; 9 1.3,-1.6; 10 1.3,-0.8; 11 1.3,0; 12 1.3,0.8 | smd 0.8 x 0.8: 2 0,1.4; 8 0,-1.4
TQFP32-08 = smd 1.27 x 0.559: 1 -4.293,2.8; 2 -4.293,2; 3 -4.293,1.2; 4 -4.293,0.4; 5 -4.293,-0.4; 6 -4.293,-1.2; 7 -4.293,-2; 8 -4.293,-2.8; 17 4.293,-2.8; 18 4.293,-2; 19 4.293,-1.2; 20 4.293,-0.4; 21 4.293,0.4; 22 4.293,1.2; 23 4.293,2; 24 4.293,2.8 | smd 0.559 x 1.27: 9 -2.8,-4.293; 10 -2,-4.293; 11 -1.2,-4.293; 12 -0.4,-4.293; 13 0.4,-4.293; 14 1.2,-4.293; 15 2,-4.293; 16 2.8,-4.293; 25 2.8,4.293; 26 2,4.293; 27 1.2,4.293; 28 0.4,4.293; 29 -0.4,4.293; 30 -1.2,4.293; 31 -2,4.293; 32 -2.8,4.293
PNA460XM = drill 1.016 pad 1.93 square: 1 -2.54,0 | drill 1.016 pad 1.93: 2 0,0; 3 2.54,0
SOT23-6L = smd 0.55 x 1.2: 1 -0.95,-1.3; 2 0,-1.3; 3 0.95,-1.3; 4 0.95,1.3; 5 0,1.3; 6 -0.95,1.3

### Placement (x,y rotation side)
BAT1  42.55,80.64 90 top
BAT2  120.02,80.64 90 top
C1  80.2,153.1 0 top
C2  102.8,155.33 250 top
C3  126.9,143.47 230 top
C4  145.34,124.11 210 top
C5  156.17,99.61 190 top
C6  157.95,73.17 170 top
C7  150.42,47.21 150 top
C8  134.58,25.56 130 top
C9  112.33,10.72 110 top
C10  86.36,4.32 90 top
C11  59.76,7.23 70 top
C12  35.72,19.09 50 top
C13  17.15,38.45 30 top
C14  6.39,62.95 10 top
C15  4.61,89.64 350 top
C16  12.14,115.35 330 top
C17  27.98,136.93 310 top
C18  50.23,151.84 290 top
C19  72.64,140.59 180 top
C20  89.53,49.85 90 top
C21  103.76,43.37 270 top
C22  96.84,48.96 270 top
C23  70.99,50.8 90 top
C24  64.77,50.8 90 top
C25  84.84,125.35 180 top
C26  71.75,127.63 90 top
C27  116.84,145.92 330 top
C28  81.92,149.86 0 top
C29  78.49,149.86 180 top
CN1  88.27,36.19 270 top
CN2  66.99,4.83 10.5 bottom
CN3  66.99,4.83 349.5 top
CN4  92.08,118.75 90 top
CN5  71.75,137.79 0 top
D1  98.17,46.86 90 top
D2  93.34,51.12 0 top
F1  45.09,42.54 0 top
F2  117.47,42.54 180 top
FRAME1  57.78,130.18 0 top
FRAME2  57.78,130.18 0 top
FRAME3  57.78,130.18 0 bottom
JP1  50.17,42.54 90 top
JP2  112.39,42.54 90 top
JP3  81.28,17.14 90 top
JP4  81.28,42.23 0 top
JP5  67.94,45.08 180 top
JP6  73.03,131.13 0 top
JP7  85.09,146.69 270 top
JP8  52.7,42.54 90 top
JP9  109.86,42.54 90 top
L1  100.33,50.93 270 top
LED1  81.28,157.48 0 top
LED2  107.34,152.88 340 top
LED3  130.26,139.65 320 top
LED4  147.27,119.38 300 top
LED5  156.32,94.51 280 top
LED6  156.32,68.05 260 top
LED7  147.27,43.18 240 top
LED8  130.26,22.91 220 top
LED9  107.34,9.68 200 top
LED10  81.28,5.08 180 top
LED11  55.22,9.68 160 top
LED12  32.3,22.91 140 top
LED13  15.29,43.18 120 top
LED14  6.24,68.05 100 top
LED15  6.24,94.51 80 top
LED16  15.29,119.38 60 top
LED17  32.3,139.65 40 top
LED18  55.22,152.88 20 top
LED19  86.36,22.86 270 top
LED20  81.28,22.86 270 top
LED21  76.2,22.86 270 top
R1  75.69,140.59 0 top
R2  96.65,44.13 180 top
R3  99.95,44.13 180 top
R4  99.95,42.61 0 top
R5  103,46.04 0 top
R6  71.06,47.62 270 top
R7  84.84,132.46 0 top
R8  81.79,132.46 0 top
R9  84.84,130.43 0 top
R10  84.84,128.4 180 top
R11  86.36,27.94 90 top
R12  81.28,27.94 90 top
R13  76.2,27.94 90 top
SW1  97.79,114.3 90 top
SW2  74.68,114.3 90 top
TP1  120.02,143.19 0 top
TP2  83.19,145.41 0 top
TP3  83.19,147.95 0 top
TP4  54.1,148.46 0 top
TP5  72.39,47.62 0 top
TP6  72.39,46.35 0 top
TP7  83.95,134.11 0 top
TP8  83.95,126.87 0 top
TP9  89.41,47.05 0 top
TP10  89.41,46.16 0 top
TP11  72.39,48.89 0 top
TP12  64.77,48.89 0 top
TP13  81.34,51.69 0 top
TP14  81.22,111.51 0 top
U1  93.34,47.31 0 top
U2  67.94,48.89 0 top
U3  78.11,126.36 0 top
U4  119.38,147.32 150 top
U5  80.64,146.69 0 top
U$1  [STRICH-LOGO]  126.87,16.64 35 top

### Tracks (layer width: path | path; a pad name or v marks a point on that pad's centre or on a via)
5V  (via drill 0.6)
  Top 0.254: U5.6 79.7,149.5 C29.1 79.34,153.08 | R12.2 v81.28,35.24 | v66.04,44.13 66.36,44.45 66.99,45.08 | LED1.1 77.47,157.72 77.47,154.94 79.31,153.1 C1.1 | v33.15,21.91 LED12.1 C12.1 | C2.1 LED2.1 | C3.1 LED3.1 | C4.1 LED4.1 | C5.1 LED5.1 | C6.1 LED6.1 | C7.1 LED7.1 | C8.1 LED8.1 | C9.1 LED9.1 | C10.1 LED10.1 | C11.1 LED11.1 | C13.1 LED13.1 | C14.1 LED14.1 | C15.1 LED15.1 | C16.1 LED16.1 | C17.1 LED17.1 | C18.1 LED18.1
  Top 0.406: v54.8,152.84 53.98,153.67 52.49,153.67 LED18.1 | v31.5,139.19 30.99,139.7 29.79,139.7 LED17.1 | v14.67,118.75 13.36,118.75 LED16.1 | v5.78,93.35 5.2,93.35 LED15.1 | 6.28,67.87 v6.1,67.69 5.08,66.68 LED14.1 | LED13.1 14.61,40.78 14.61,41.91 14.92,42.23 v15.37,42.61 | v56.52,9.02 56.52,7.79 LED11.1 | LED10.1 83.42,3.18 83.19,3.18 82.13,4.23 82.13,4.93 v82.11,4.95 | LED9.1 110.07,8.89 108.9,8.89 108.59,9.21 108.01,9.78 v107.95,9.78 | LED8.1 131.58,23.26 131.39,23.44 131.21,23.62 v131.19,23.62 | v156.53,69.21 157.36,69.21 LED6.1 | LED5.1 156.23,95.96 156.22,95.96 v156.08,95.82 | v146.69,120.33 147.32,120.97 147.32,122.19 LED4.1 | v129.86,140.02 129.86,142.01 LED3.1 | v107,153.04 107,154.3 106.08,155.23 LED2.1 105.73,155.26 | LED1.1 80.43,157.48 v80.33,157.54 | LED7.1 148.09,44.5 v148.08,44.51 | 79.34,153.08 C1.1
  Top 0.635: C24.1 TP12.P$1 64.77,46.67 66.36,45.08 66.99,45.08 JP5.2 | U2.4 U2.5 U2.6
  Top 0.762: TP12.P$1 U2.5
  Bottom 0.254: v81.28,35.24 72.39,44.13 v66.04,44.13
  Bottom 0.508: 64.77,17.27 v56.52,9.02
  Bottom 0.762: v131.19,23.62 v148.08,44.51 v156.53,69.21 v156.08,95.82 v146.69,120.33 v129.86,140.02 129.86,143.19 127,146.05 114.3,153.04 v107,153.04 v80.33,157.54 v54.8,152.84 v31.5,139.19 v14.67,118.75 v5.78,93.35 v6.1,67.69 v15.37,42.61 v33.15,21.91 v56.52,9.02 | v131.19,23.62 131.13,23.5 | v131.19,23.62 v107.95,9.78 v82.11,4.95 76.71,4.95 73.66,1.91 60.77,4.25 60.71,4.25 56.83,8.13 56.83,8.57 56.52,8.89 | TP12.P$1 64.77,17.27
5V_LED
  Top 0.254: LED20.A R12.1
!RESET  (via drill 0.6)
  Top 0.254: C19.1 R1.1 74.84,140.11 75.56,139.38 77.47,139.38 78.11,138.75 78.11,132.08 77.79,131.76 77.7,131.68 U3.29 77.7,128.35 v77.79,128.27 | CN4.5 93.66,123.82 95.25,122.24 95.54,121.95 SW1.B2
  Bottom 0.254: CN4.5 92.08,125.41 89.85,127.64 78.42,127.64 v77.79,128.27
AREF
  Top 0.254: U3.20 83.37,125.96 C25.2
BAT1_F
  Top 0.762: BAT1.PWR@1 42.55,43.03 F1.1
BAT1_PREJMP
  Top 0.635: 51.89,43.82 JP8.2
  Top 0.762: F1.2 48.9,42.54 JP1.2 51.89,43.82
BAT2_F
  Top 0.762: F2.1 119.52,49.51 BAT2.PWR@1
BAT2_PREJMP
  Top 0.635: 110.67,43.82 JP9.2
  Top 0.762: F2.2 114.16,43.82 JP2.2 110.67,43.82
BATT_LVL
  Top 0.254: TP8.P$1 83.95,128.36 R10.2 | U3.23 83.95,128.36 R10.2 | R9.1 R10.2
BATTMON_EN
  Top 0.406: U3.25 82.4,130.66 83.19,131.44 85.41,131.44 85.72,131.13 85.72,130.47 R9.2
CHG_BOOST
  Top 0.406: U1.11 96.74,48.28 C22.2 97.35,47.86 D1.C
CHG_SENSE
  Top 0.406: 99,46.86 96.96,46.86 96.2,47.63 95.45,47.63 U1.10
  Top 0.762: 99,46.86 99.99,47.86 L1.2 101.6,46.54 R5.1
CHG_SW
  Top 0.406: 95.44,51.07 D2.C | U1.12 95.92,48.93 96.33,49.34 96.64,49.34 C22.1
  Top 0.508: U1.12 95.44,51.07
  Top 0.762: L1.1 98.41,54.03 D2.C
CHG_VFB
  Top 0.406: U1.7 95.44,44.48 R2.2
CHG_VFB_CTR
  Top 0.762: R2.1 R3.2 R4.1
CHGSTAT_!CHARGE
  Top 0.254: U1.4 89.48,46.98 TP9.P$1 77.79,47.05 54.8,70.04 54.8,104.33 70.17,119.7 74.93,119.7 75.88,120.65 76.11,120.87 U3.10
CHGSTAT_!FAULT
  Top 0.254: U1.5 89.58,46.33 | 89.58,46.33 TP10.P$1 | 89.58,46.33 TP10.P$1 | TP10.P$1 77.98,46.16 54.29,69.85 54.29,104.77 69.85,120.33 72.39,120.33 74.3,120.33 74.36,120.33 74.61,120.33 75.25,120.97 75.31,121.03 U3.9
DTR_RESET
  Top 0.254: CN5.1 71.75,140.55 C19.2
GND  (via drill 0.6)
  other vias: 82.55,40 80.01,40 102.23,42.61 81.28,160.97 75.56,127.95 75.56,46.04 83.19,146.69 14.92,124.78 141.92,40.32 80.01,118.36 92.39,44.45 93.34,43.5 94.3,42.54 93.98,50.48 92.71,50.48 92.71,51.75 93.98,51.75 92.71,40.96 91.76,41.91 90.81,42.86
  pour Top: 0.64,163.19 0.64,0.63 163.19,0.63 163.19,163.19
  pour Bottom: 0.64,163.19 0.64,0.63 163.19,0.63 163.19,163.19
IR_DATA
  Top 0.254: U4.1 121.58,144.76 TP1.P$1 120.02,140.65 95.57,116.21 80.96,116.21 77.47,119.7 77.47,120.65 77.7,120.89 U3.12
LED_GND
  Top 0.254: JP3.2 LED20.C | LED20.C LED21.C | LED20.C 81.51,21.36 81.6,21.27 86.27,21.27 LED19.C
LEDDAT_1-2
  Top 0.254: LED1.2 80.95,155.88 82.55,157.48 106.26,157.48 LED2.4
LEDDAT_2-3
  Top 0.254: LED3.4 133.17,140.52 128.59,145.1 116.52,151.77 104.95,151.77 LED2.2
LEDDAT_3-4
  Top 0.254: LED3.2 127.36,139.98 128.91,138.43 132.08,138.43 141.92,128.59 143.83,128.59 149.86,122.56 149.86,118.08 LED4.4
LEDDAT_4-5
  Top 0.254: LED4.2 144.66,114.74 158.75,100.65 158.75,92.8 LED5.4
LEDDAT_5-6
  Top 0.254: LED5.2 154.32,95.23 156.84,92.71 156.84,77.47 160.34,73.98 160.34,68.22 LED6.4
LEDDAT_6-7
  Top 0.254: LED7.4 148.53,40.26 152.4,44.13 152.4,61.59 155.38,64.58 155.38,70.46 155.38,70.53 | 155.38,70.53 LED6.2 155.19,70.74 155.26,70.8 155.38,70.68 155.38,70.53
LEDDAT_7-8
  Top 0.254: LED7.2 144.53,46.1 139.7,41.28 139.7,26.67 133.83,20.8 | 133.83,20.8 133.35,20.32 | LED8.4 133.14,20.11 133.83,20.8
LEDDAT_8-9
  Top 0.254: LED8.2 129.54,24.14 129.54,22.54 116.84,9.84 114.94,9.84 112.43,7.33 LED9.4
LEDDAT_9-10
  Top 0.254: LED9.2 108.83,11.75 107.57,11.75 99.63,3.81 99.57,3.81 91.76,3.81 89.53,1.59 87.95,1.59 80.72,1.59 LED10.4
LEDDAT_10-11  (via drill 0.6)
  Top 0.254: v63.5,12.38 63.5,8.57 60.01,5.08 56.3,5.08 LED11.4 | v77.47,12.38 78.03,12.38 LED10.2
  Bottom 0.254: v77.47,12.38 v63.5,12.38
LEDDAT_11-12
  Top 0.254: LED12.4 29.21,23.07 29.21,21.91 34.61,16.51 36.83,16.51 40.01,13.33 42.36,10.98 57.43,10.98 LED11.2
LEDDAT_12-13
  Top 0.254: LED12.2 33.96,22.56 32.7,23.81 31.43,23.81 19.69,35.56 17.14,35.56 12.38,40.32 12.38,44.21 LED13.4
LEDDAT_13-14
  Top 0.254: LED13.2 17.9,48.14 3.49,62.55 3.49,69.44 LED14.4
LEDDAT_14-15
  Top 0.254: LED14.2 8.24,67.33 5.72,69.85 5.72,85.41 2.54,88.58 2.54,94.66 LED15.4
LEDDAT_15-16
  Top 0.254: LED15.2 7.39,94.53 6.67,95.25 6.67,109.22 9.53,112.08 9.53,116.7 LED16.4
LEDDAT_16-17
  Top 0.254: LED17.4 32.94,142.24 30.16,142.24 16.51,128.59 16.51,118.43 16.51,117.52 LED16.2
LEDDAT_17-18
  Top 0.254: LED17.2 31.45,137.18 33.02,138.75 33.02,140.02 35.56,142.56 37.15,142.56 49.85,155.26 56.94,155.26 LED18.4
LEDDAT_IN-5V  (via drill 0.6)
  Top 0.254: JP7.1 84.27,147.96 TP3.P$1 83.16,147.99 U5.4 | LED1.4 81.59,159.08 80.01,160.66 77.47,160.66 76.2,159.38 76.2,148.59 v76.84,147.96
  Bottom 0.254: v76.84,147.96 TP3.P$1
LEDDAT_IN-BATT
  Top 0.254: TP2.P$1 84.27,145.42 JP7.2 | U5.3 83.16,145.39 TP2.P$1 | U3.27 79.31,134.55 80.64,135.89 80.64,142.88 TP2.P$1
LEDDAT_OUT
  Top 0.406: LED18.2 54.1,149.9 TP4.P$1
MISO
  Top 0.254: U3.16 88.42,122.07 88.9,122.56 90.62,122.56 91.06,122.11 91.06,119.76 CN4.1
MOSI
  Top 0.254: U3.15 80.11,121.19 80.33,120.97 89.47,120.97 CN4.4
NONSOLAR
  Top 0.254: JP6.2 74.84,131.13 U3.32
RS232-RX
  Top 0.254: U3.30 76.91,137.72 CN5.3
RS232-TX
  Top 0.254: U3.31 76.11,133.13 74.3,134.94 CN5.2
SCK
  Top 0.254: CN4.3 92.33,121.67 90.81,123.19 90.81,124.78 90.17,125.41 88.58,125.41 86.73,123.57 U3.17
SET_LIGHT_THRESH
  Top 0.254: U3.11 76.91,118.3 SW2.A2
SOLAR_IN  (via drill 0.6)
  Top 0.254: R13.2 76.2,37.96 JP4.1 | v87.98,48.93 v87.98,51.47 | R7.2 89.79,132.46 v89.85,132.4
  Top 0.508: U1.3 U1.2 U1.1 89.55,48.93 C20.1
  Top 0.635: JP4.1 76.52,42.23 v76.14,41.85
  Top 0.762: v87.98,48.93 89.52,48.93 C20.1
  Bottom 0.254: v89.85,132.4 108.59,113.67 108.59,69.53 95.25,56.2 90.49,51.43 88.02,51.43 v87.98,51.47
  Bottom 0.762: CN1.PWR 102.14,36.96 90.17,48.93 v87.98,48.93 81.28,42.23 76.52,42.23 v76.14,41.85
SOLAR_LED
  Top 0.254: R13.1 LED21.A
SOLAR_LVL  (via drill 0.6)
  Top 0.254: R8.2 R7.1 83.95,132.5 TP7.P$1
  Top 0.406: U3.24 81.22,129.17 v80.64,128.59
  Bottom 0.406: v80.64,128.59 80.64,132.59 82.23,134.18 83.88,134.18 TP7.P$1
USB_VBUS  (via drill 0.6)
  Top 0.406: CN3.1 66.48,9.27 66.48,9.33
  Top 0.635: 81.28,39.05 JP4.2
  Top 0.762: 66.48,9.33 v68.64,11.49 68.9,11.75 68.9,17.78 73.98,22.86 77.79,22.86 78.74,23.81 78.74,36.51 81.28,39.05
  Bottom 0.406: CN2.1 69.03,8.83 | v68.64,11.49 68.67,11.53
  Bottom 0.762: 69.03,8.83 69.03,11.18 68.67,11.53
V_BATT
  Top 0.254: C28.1 80.64,149.44 U5.5 80.64,147.13 79.7,146.18 U5.1 79.7,143.74 78.19,142.24 76.84,142.24 76.54,141.95 76.54,141.9 | R11.2 86.36,37.96 JP4.3 | U3.4 78.66,126.76 80.96,124.46 81.06,124.36 U3.18 86.58,124.36 86.68,124.46 108.56,146.35 C27.1 117.18,147.42 U4.3 | U3.6 72.95,125.17 71.75,126.36 C26.1 69.53,129.01 69.53,140.65 71.12,142.24 76.2,142.24 76.54,141.9 | 70.92,49.7 70.92,49.82 C23.1 | R1.2 76.54,141.9
  Top 0.406: C23.1 71.39,49.9 | U3.4 71.78,126.76 C26.1 | U1.9 95.96,46.98 96.58,46.36 97.03,45.91 98.12,45.91 D1.A
  Top 0.508: U2.11 U2.12 U2.1 69.25,52.99 53.66,68.58 53.66,108.69 C26.1
  Top 0.635: U2.12 70.92,49.7 | 71.39,49.9 TP11.P$1 73.03,48.89 73.66,48.26 73.66,45.72 73.03,45.08 JP5.1 68.39,43.69 | 110.67,41.28 JP9.1 107.19,42.1 | 51.89,41.28 JP8.1 66.8,42.1 66.87,42.16 | JP4.3 82.09,43.68
  Top 0.762: JP2.1 110.67,41.28 | 107.19,42.1 | 107.19,42.1 105.03,44.26 C21.1 | C21.1 104.4,44.91 R5.2 | JP1.1 51.89,41.28 | 66.87,42.16 68.39,43.69 69.91,42.16 73.03,42.16 74.87,42.16 77.15,44.45 81.32,44.45 82.09,43.68 82.87,44.45 90.81,44.45 93.98,41.28 106.36,41.28 107.19,42.1 | C21.1 100.93,44.26 R3.1 100.8,44.36 99.89,45.28 99.31,45.85 98.19,45.85 D1.A
VBATT_LED
  Top 0.254: R11.1 LED19.A
VREG_EN  (via drill 0.6)
  Top 0.254: U2.10 70.74,48.1 70.74,48.16 R6.1 | U3.13 78.5,120.1 v78.42,120.01
  Top 0.406: R6.1 71.54,48.47 TP5.P$1
  Bottom 0.254: 78.11,119.7 53.02,94.62 53.02,66.99 71.54,48.47 TP5.P$1 | 78.11,119.7 v78.42,120.01 78.11,119.7
VREG_PG  (via drill 0.6)
  Top 0.254: U2.9 70.6,47.29 70.6,47.23 R6.2 | U3.14 79.31,119.31 v79.19,119.19
  Top 0.406: R6.2 71.97,46.78 TP6.P$1
  Bottom 0.254: TP6.P$1 73.34,47.31 73.34,48.89 71.12,51.12 53.66,68.58 53.66,93.66 v79.19,119.19

### Text on the board
tPlace: LED 1 | LED 18 | LED Data In / (5V) | LED Data Out | Shift / Byp | LED Data In / (VBatt) | IR Data | GRN | BLK | RS232 | Solar Lvl | Non / Solar | Batt Lvl | ISP | Set Light / Threshold | GND | Reset | UCBeacon | Battery A | 18650 LiFePO4 | Battery B | 18650 LiFePO4 | (C) 2016 sen / Licensed under Creative Commons / CC BY-SA | GND | +5V | VBatt | 5V EN | !CHARGE | 5V PG | !FAULT | Battery A / Active | Regulator / Bypass | USB / Charge | USB / Power | Battery B / Active | ECO | A | C | B | D | Solar | +5V | Batt | Rev001 | LEDs / Active
bPlace: http://hackstrich.sen.cx/UCBeacon | Serial